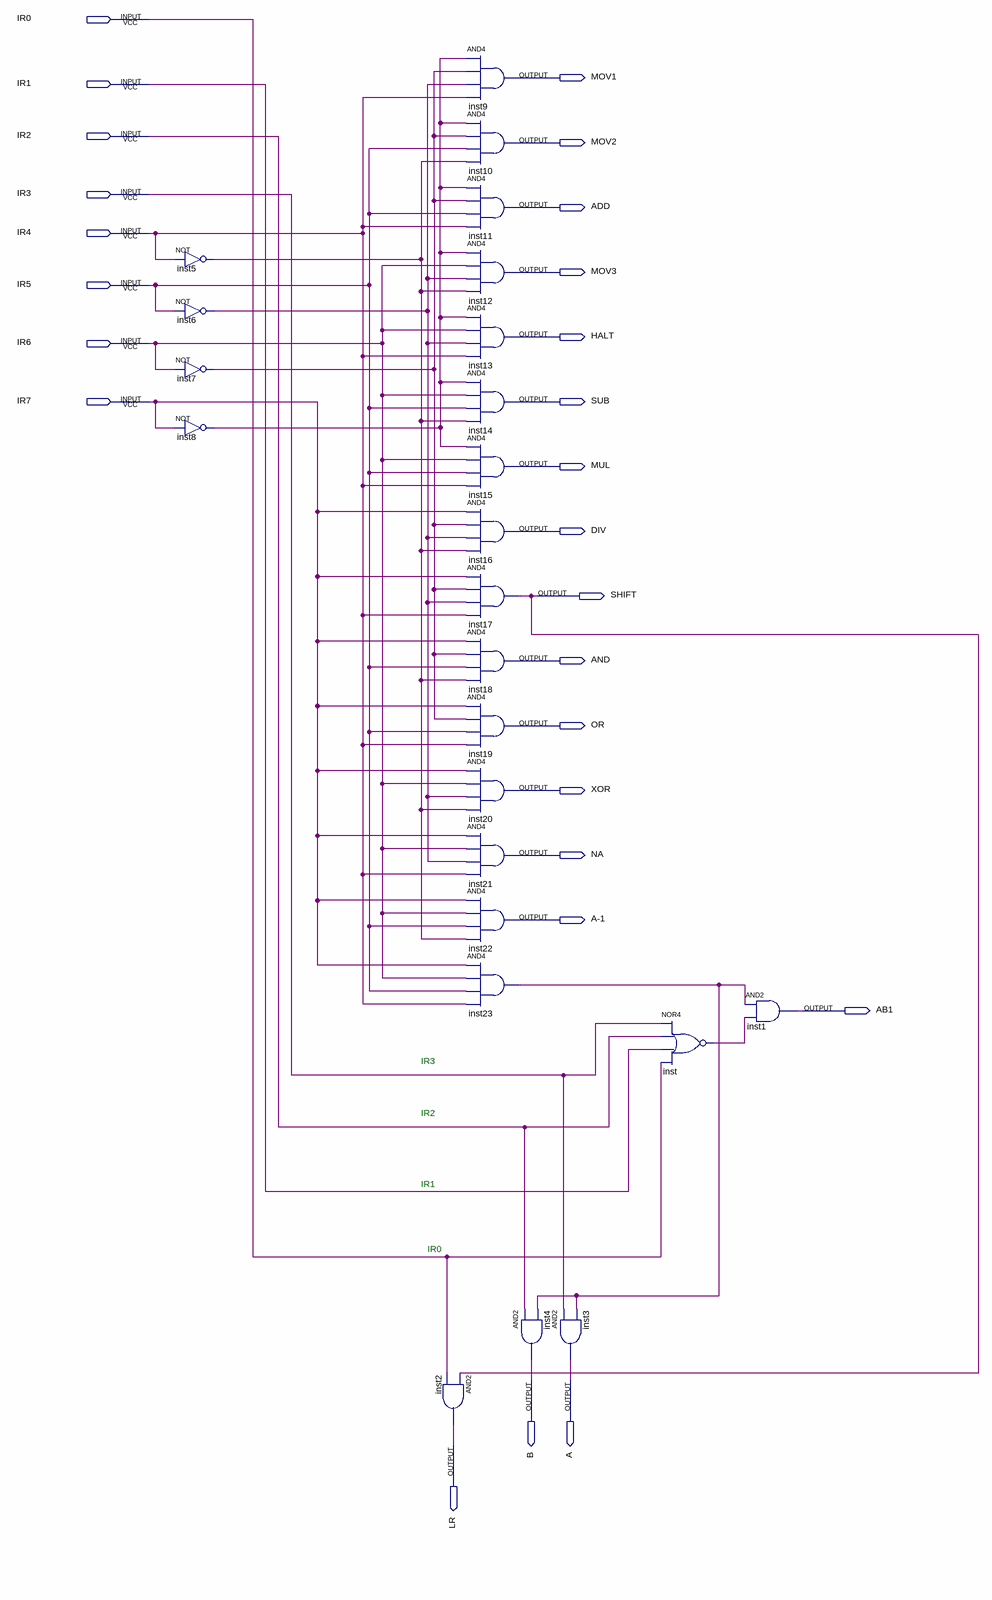
[diagram p0: schematic sheet]
// Quartus schematic control.bdf as structural Verilog: 24 symbols, 26 pins
module control (
  input  IR0,
  input  IR1,
  input  IR2,
  input  IR3,
  input  IR4,
  input  IR5,
  input  IR6,
  input  IR7,
  output MOV1,
  output MOV2,
  output ADD,
  output MOV3,
  output HALT,
  output SUB,
  output MUL,
  output DIV,
  output SHIFT,
  output AND,
  output OR,
  output XOR,
  output NA,
  output \A-1 ,
  output AB1,
  output B,
  output A,
  output LR
);

  wire inst5_out, inst6_out, inst7_out, inst8_out, inst23_out, inst_out;

  not inst5 (inst5_out, IR4);
  not inst6 (inst6_out, IR5);
  not inst7 (inst7_out, IR6);
  not inst8 (inst8_out, IR7);
  and inst9 (MOV1, inst8_out, inst7_out, inst6_out, IR4);
  and inst10 (MOV2, inst8_out, inst7_out, IR5, inst5_out);
  and inst11 (ADD, inst8_out, inst7_out, IR5, IR4);
  and inst12 (MOV3, inst8_out, IR6, inst6_out, inst5_out);
  and inst13 (HALT, inst8_out, IR6, inst6_out, IR4);
  and inst14 (SUB, inst8_out, IR6, IR5, inst5_out);
  and inst15 (MUL, inst8_out, IR6, IR5, IR4);
  and inst16 (DIV, IR7, inst7_out, inst6_out, inst5_out);
  and inst17 (SHIFT, IR7, inst7_out, inst6_out, IR4);
  and inst18 (AND, IR7, inst7_out, IR5, inst5_out);
  and inst19 (OR, IR7, inst7_out, IR5, IR4);
  and inst20 (XOR, IR7, IR6, inst6_out, inst5_out);
  and inst21 (NA, IR7, IR6, inst6_out, IR4);
  and inst22 (\A-1 , IR7, IR6, IR5, inst5_out);
  and inst23 (inst23_out, IR7, IR6, IR5, IR4);
  and inst2 (LR, SHIFT, IR0);
  and inst4 (B, IR2, inst23_out);
  and inst3 (A, IR3, inst23_out);
  nor inst (inst_out, IR3, IR2, IR1, IR0);
  and inst1 (AB1, inst23_out, inst_out);

  // Notes on the sheet:
  //   IR3
  //   IR2
  //   IR1
  //   IR0
endmodule
